# EAGLE schematic ciabatta (EAGLE 4.16)
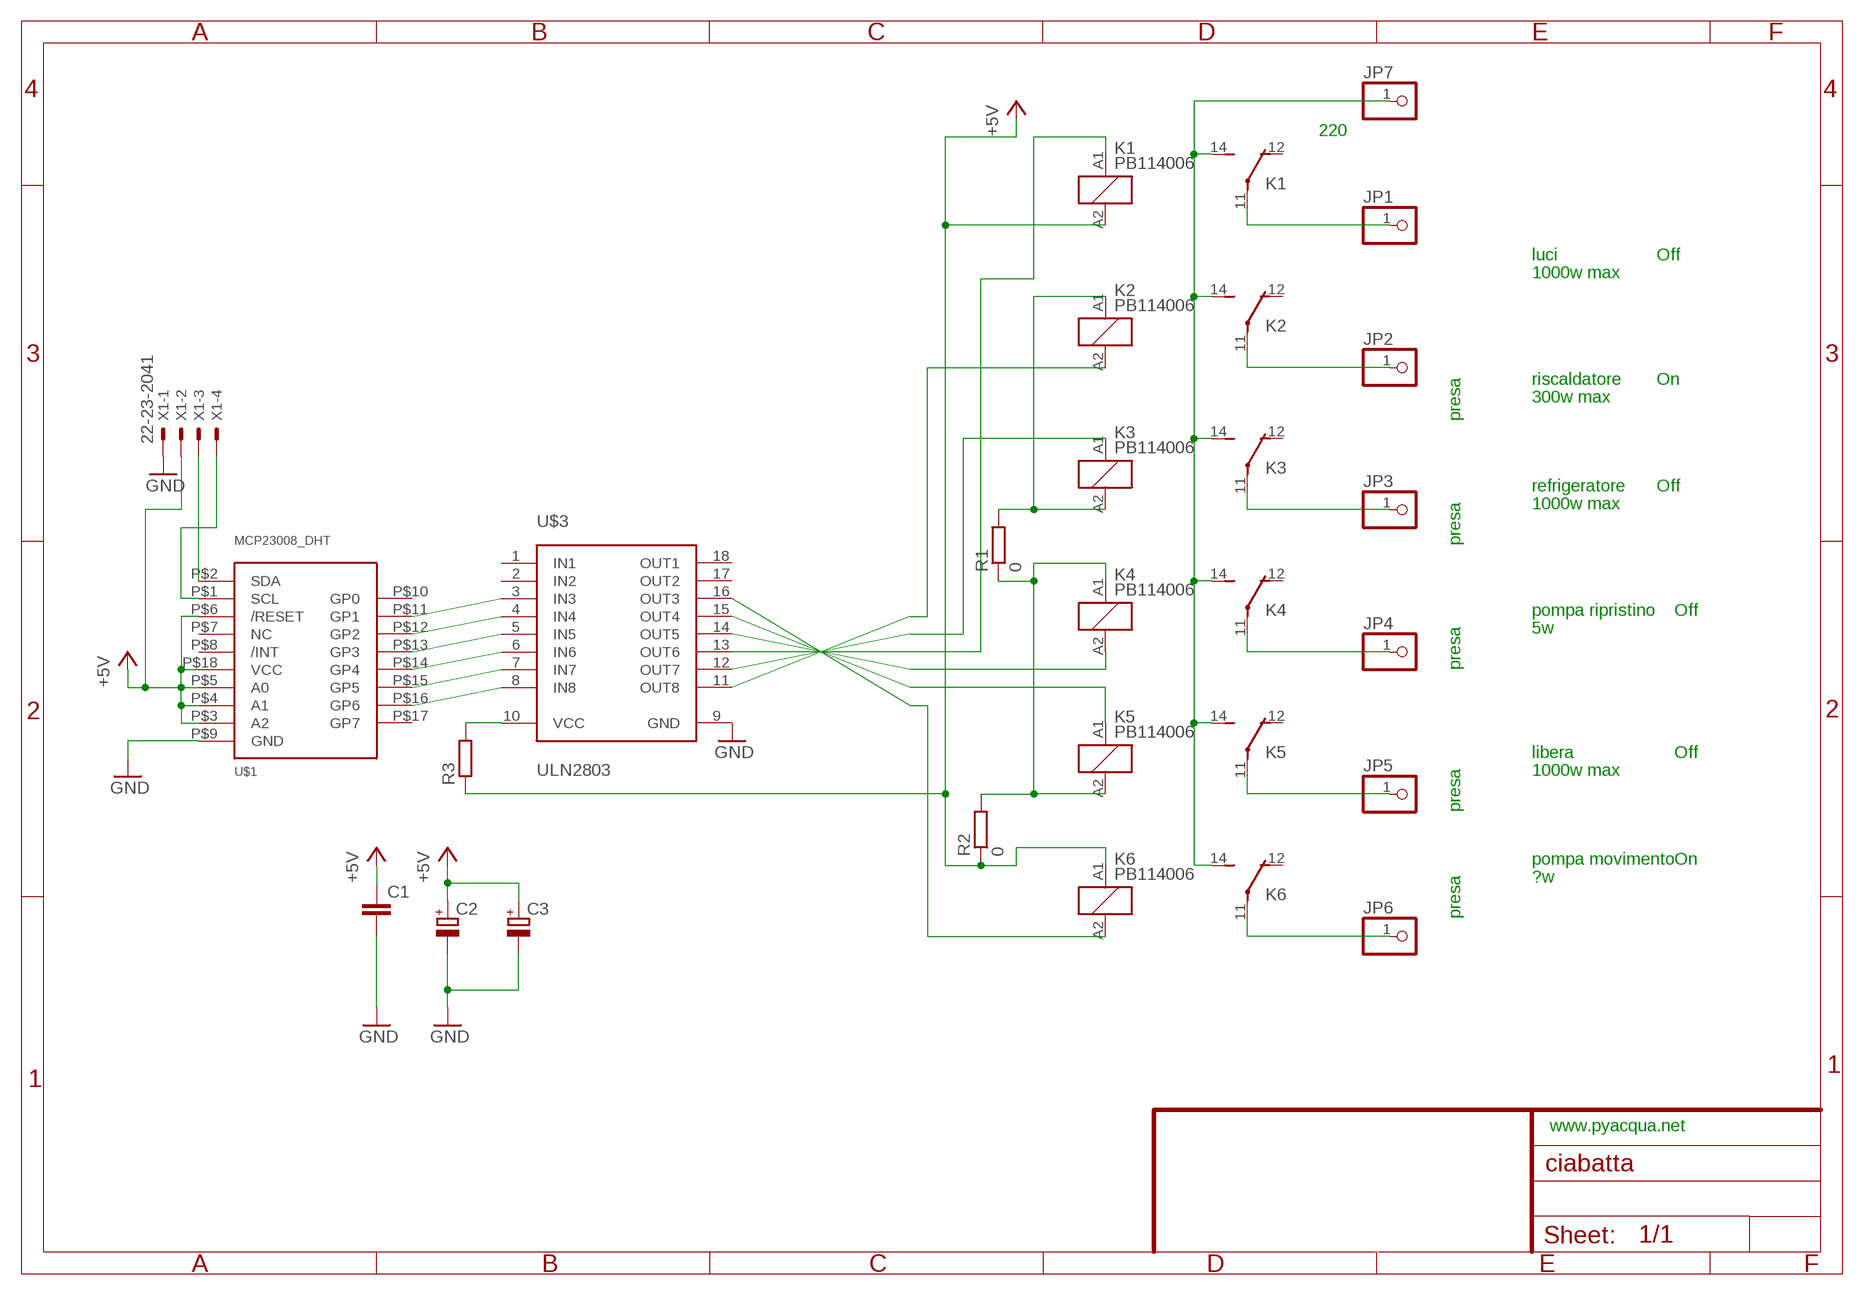
[diagram p0: schematic, sheet 1]

## Parts
C1  C-EUC0603  [C0603]
C2  CPOL-EUE2.5-6  [E2,5-6]
C3  CPOL-EUE2.5-6  [E2,5-6]
JP1  PINHD-1X1  [1X01]
JP2  PINHD-1X1  [1X01]
JP3  PINHD-1X1  [1X01]
JP4  PINHD-1X1  [1X01]
JP5  PINHD-1X1  [1X01]
JP6  PINHD-1X1  [1X01]
JP7  PINHD-1X1  [1X01]
K1  PB114006  [PB]
K2  PB114006  [PB]
K3  PB114006  [PB]
K4  PB114006  [PB]
K5  PB114006  [PB]
K6  PB114006  [PB]
R1  0  R-EU_0207/15  [0207/15]
R2  0  R-EU_0207/15  [0207/15]
R3  R-EU_0204/7  [0204/7]
U$1  MCP23008_DHT  [MCP23008_DHT]
U$3  ULN2803  [ULN2803]
X1  22-23-2041  [22-23-2041]

## Nets
+5V [vcc]: C1.1 C2.+ C3.+ K1.A2 K6.A1 R2.1 R3.1 U$1.P$3(A2) U$1.P$4(A1) U$1.P$5(A0) U$1.P$6(/RESET) U$1.P$18(VCC) X1.2
CH1: K2.A1 K3.A2 R1.2
CH2: K2.A2 U$3.11(OUT8)
CH5: K5.A1 U$3.15(OUT4)
CH6: K6.A2 U$3.16(OUT3)
GND: C1.2 C2.- C3.- U$1.P$9(GND) U$3.9(GND) X1.1
N$1: U$1.P$2(SDA) X1.3
N$2: U$1.P$1(SCL) X1.4
N$3: U$1.P$11(GP1) U$3.3(IN3)
N$4: U$1.P$12(GP2) U$3.4(IN4)
N$5 [220]: JP7.1 K1.14(2:S) K2.14(2:S) K3.14(2:S) K4.14(2:S) K5.14(2:S) K6.14(2:S)
N$6: U$1.P$13(GP3) U$3.5(IN5)
N$7 [220]: JP6.1 K6.11(2:P)
N$8 [220]: JP5.1 K5.11(2:P)
N$9: U$1.P$14(GP4) U$3.6(IN6)
N$10 [220]: JP4.1 K4.11(2:P)
N$11: U$1.P$15(GP5) U$3.7(IN7)
N$12 [220]: JP3.1 K3.11(2:P)
N$13: U$1.P$16(GP6) U$3.8(IN8)
N$14 [220]: JP2.1 K2.11(2:P)
N$15: R3.2 U$3.10(VCC)
N$16 [220]: JP1.1 K1.11(2:P)
N$22: K4.A1 K5.A2 R1.1 R2.2
N$25: K4.A2 U$3.14(OUT5)
N$26: K1.A1 U$3.13(OUT6)
N$27: K3.A1 U$3.12(OUT7)
Unconnected: K1.12(2:O) K2.12(2:O) K3.12(2:O) K4.12(2:O) K5.12(2:O) K6.12(2:O) U$1.P$7(NC) U$1.P$8(/INT) U$1.P$10(GP0) U$1.P$17(GP7) U$3.1(IN1) U$3.2(IN2) U$3.17(OUT2) U$3.18(OUT1)

## Notes on the sheet
- 220
- luci | Off
- 1000w max
- riscaldatore | On
- 300w max
- presa
- refrigeratore | Off
- 1000w max
- presa
- pompa ripristino | Off
- 5w
- presa
- libera | Off
- 1000w max
- presa
- pompa movimento | On
- ?w
- presa
- www.pyacqua.net

## Library data of the parts
C1 = rcl:C-EU: CAPACITOR, European symbol
C2 C3 = rcl:CPOL-EU: POLARIZED CAPACITOR, European symbol
JP1-JP7 = pinhead:PINHD-1X1: PIN HEADER
K1-K6 = relay:PB?14*: Miniature Power PCB Relay SCHRACK 1pole 10 A Source: http://www.schrack.com/.. 5846.pdf
R1-R3 = rcl:R-EU_: RESISTOR, European symbol
U$1 = aggiunte:MCP23008_DHT: MCP23008 I2C EXPANDER 8 Ch
U$3 = aggiunte:ULN2803: ULN 2803 8 transistor array
X1 = con-molex:22-23-2041: .100" (2.54mm) Center Header - 4 Pin

## Net classes
0 signal: width 0.508 mm
1 220: width 2.54 mm
2 signal2: width 0.508 mm
3 vcc: width 1.016 mm
4 smd: width 0.203 mm